# EAGLE schematic CANIso (EAGLE 6.4)
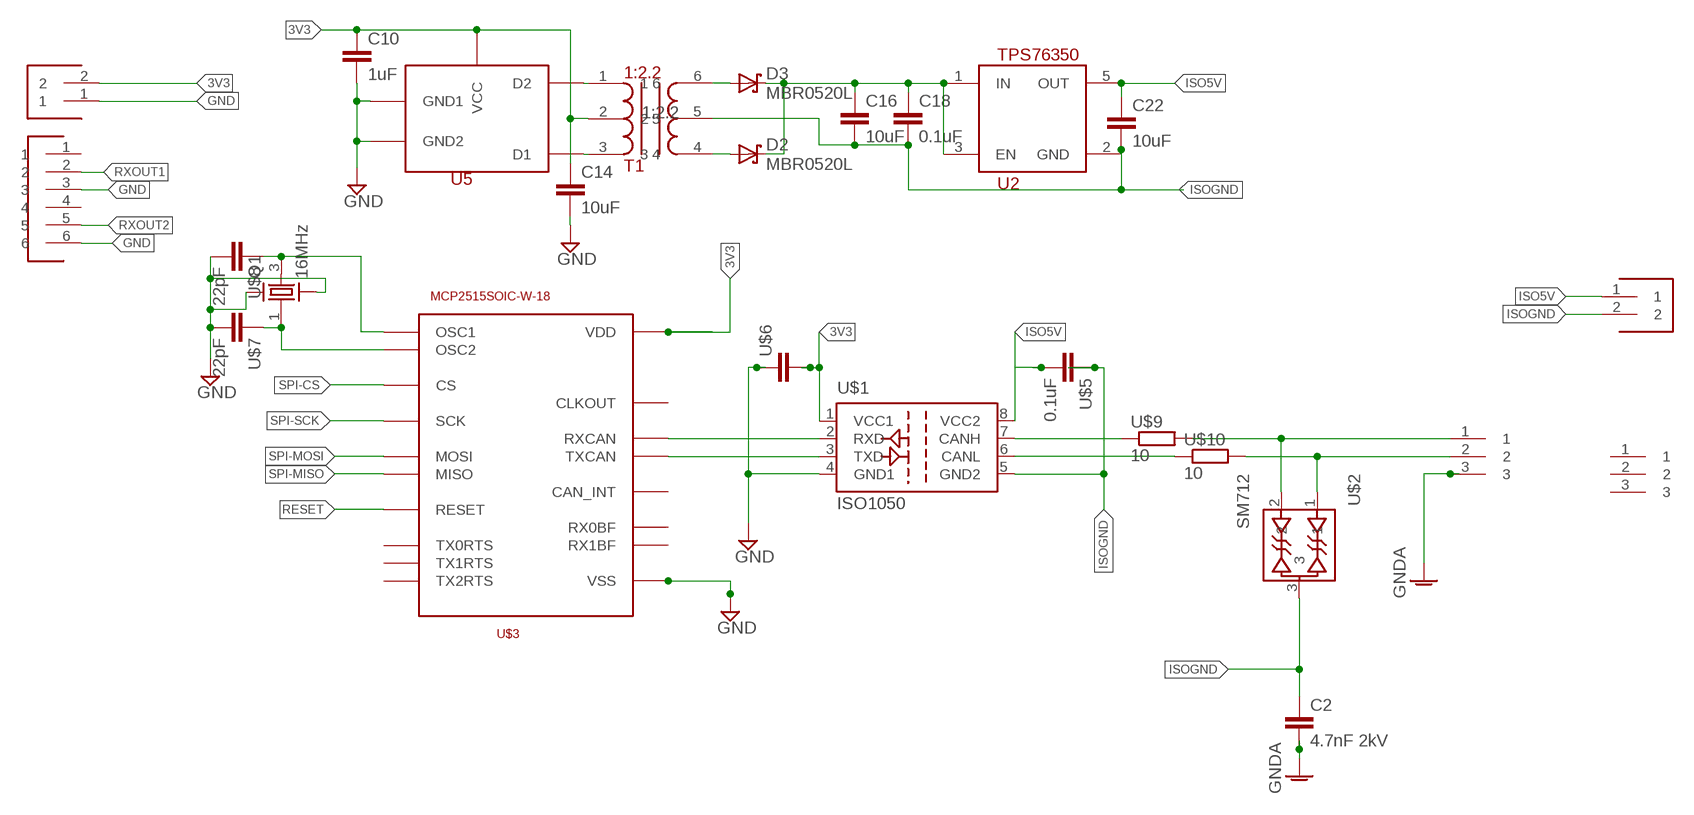
[diagram p0: schematic, sheet 1]

## Parts
C2  4.7nF 2kV  CAP0805  [0805]
C10  1uF  CAP0805  [0805]
C14  10uF  CAP0805  [0805]
C16  10uF  CAP0805  [0805]
C18  0.1uF  CAP0805  [0805]
C22  10uF  CAP0805  [0805]
D2  MBR0520L  [SOD123]
D3  MBR0520L  [SOD123]
J1  CON-2STD-2.54  [CON-2]
J3  CON-2STD-2.54  [CON-2]
J4  CON-6  [CON-6]
Q1  16MHz  ABM3B  [ABM3B]
T1  1:2.2  WE-PP-ISO-TRANSFORMER760390013  [WE_TRANSFORMER]
U2  TPS76350  [SOT23-5L]
U5  SN6501DBVT  [SOT23-5L]
U$1  ISO1050  [DUB]
U$2  SM712  [SOT23-3L]
U$3  MCP2515SOIC-W-18  [SOIC-W-18]
U$4  CON-3  [CON-3]
U$5  0.1uF  CAP0805  [0805]
U$6  CAP0805  [0805]
U$7  22pF  CAP0805  [0805]
U$8  22pF  CAP0805  [0805]
U$9  10  RES0805  [0805]
U$10  10  RES0805  [0805]
U$11  CON-3  [CON-3]

## Nets
3V3: C10.1 C14.1 J1.2 T1.2 U5.2(VCC) U$1.1(VCC1) U$3.18(VDD) U$6.2
GND: C10.2 C14.2 J1.1 J4.3 J4.6 Q1.2(GND) Q1.4(GND2) U5.4(GND1) U5.5(GND2) U$1.4(GND1) U$3.9(VSS) U$6.1 U$7.2 U$8.2
GNDA: C2.2 U$4.3
ISO5V: C22.1 J3.1 U2.5(OUT) U$1.8(VCC2)
ISOGND: C2.1 C16.2 C18.2 C22.2 J3.2 T1.5 U2.2(GND) U$1.5(GND2) U$2.3 U$5.1
LDOIN: C16.1 C18.1 D2.C D3.C U2.1(IN) U2.3(EN)
N$1: D3.A T1.6
N$2: D2.A T1.4
N$3: U$1.7(CANH) U$9.1
N$4: T1.1 U5.3(D2)
N$5: T1.3 U5.1(D1)
N$6: U$1.2(RXD) U$3.2(RXCAN)
N$7: U$1.3(TXD) U$3.1(TXCAN)
N$8: U$2.2 U$4.1 U$9.2
N$9: Q1.3 U$3.8(OSC1) U$8.1
N$10: Q1.1 U$3.7(OSC2) U$7.1
N$11: U$2.1 U$4.2 U$10.2
N$12: U$1.6(CANL) U$10.1
N$13: U$5.2
RESET: U$3.17(RESET)
RXOUT1: J4.2
RXOUT2: J4.5
SPI-CS: U$3.16(CS)
SPI-MISO: U$3.15(MISO)
SPI-MOSI: U$3.14(MOSI)
SPI-SCK: U$3.13(SCK)
Unconnected: J4.1 J4.4 U$3.3(CLKOUT) U$3.4(TX0RTS) U$3.5(TX1RTS) U$3.6(TX2RTS) U$3.10(RX1BF) U$3.11(RX0BF) U$3.12(CAN_INT) U$11.1 U$11.2 U$11.3

## Library data of the parts
C2 C10 C14 C16 C18 C22 U$5-U$8 = __bo_caps:CAP
D2 D3 = __my:MBR0520L
J1 J3 = __my:CON-2
J4 = __my:CON-6
Q1 = __my:ABM3B: CRYSTAL
T1 = __my:WE-PP-ISO-TRANSFORMER; TURNS: 1:2.2; VOLT: 3.3V -> 5V
U2 = __my:TPS76350
U5 = __my:SN6501DBVT
U$1 = __my:ISO1050
U$2 = __my:SM712
U$3 = __my:MCP2515
U$4 U$11 = __my:CON-3
U$9 U$10 = __bo_caps:RES